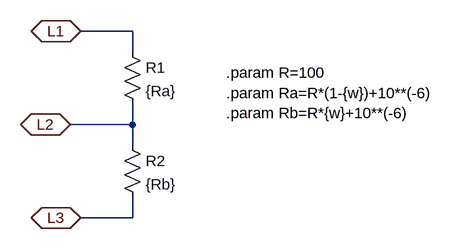
[diagram p0: schematic Base_BxxxK.asc]
Base_BxxxK.asc, the LTspice schematic file:
Version 4
SHEET 1 880 680
WIRE 192 16 112 16
WIRE 192 48 192 16
WIRE 192 160 192 128
WIRE 192 160 96 160
WIRE 192 192 192 160
WIRE 192 304 192 272
WIRE 192 304 112 304
FLAG 112 16 L1
IOPIN 112 16 BiDir
FLAG 96 160 L2
IOPIN 96 160 BiDir
FLAG 112 304 L3
IOPIN 112 304 BiDir
SYMBOL res 176 32 R0
SYMATTR InstName R1
SYMATTR Value {Ra}
SYMBOL res 176 176 R0
SYMATTR InstName R2
SYMATTR Value {Rb}
TEXT 336 80 Left 2 !.param R=100\n.param Ra=R*(1-{w})+10**(-6)\n.param Rb=R*{w}+10**(-6)

The netlist it stands for:
* Base_BxxxK.asc
R1 L1 L2 {Ra}
R2 L2 L3 {Rb}
.param R=100
.param Ra=R*(1-{w})+10**(-6)
.param Rb=R*{w}+10**(-6)
.backanno
.end